# Altium schematic sheet power.SchDoc
size A4
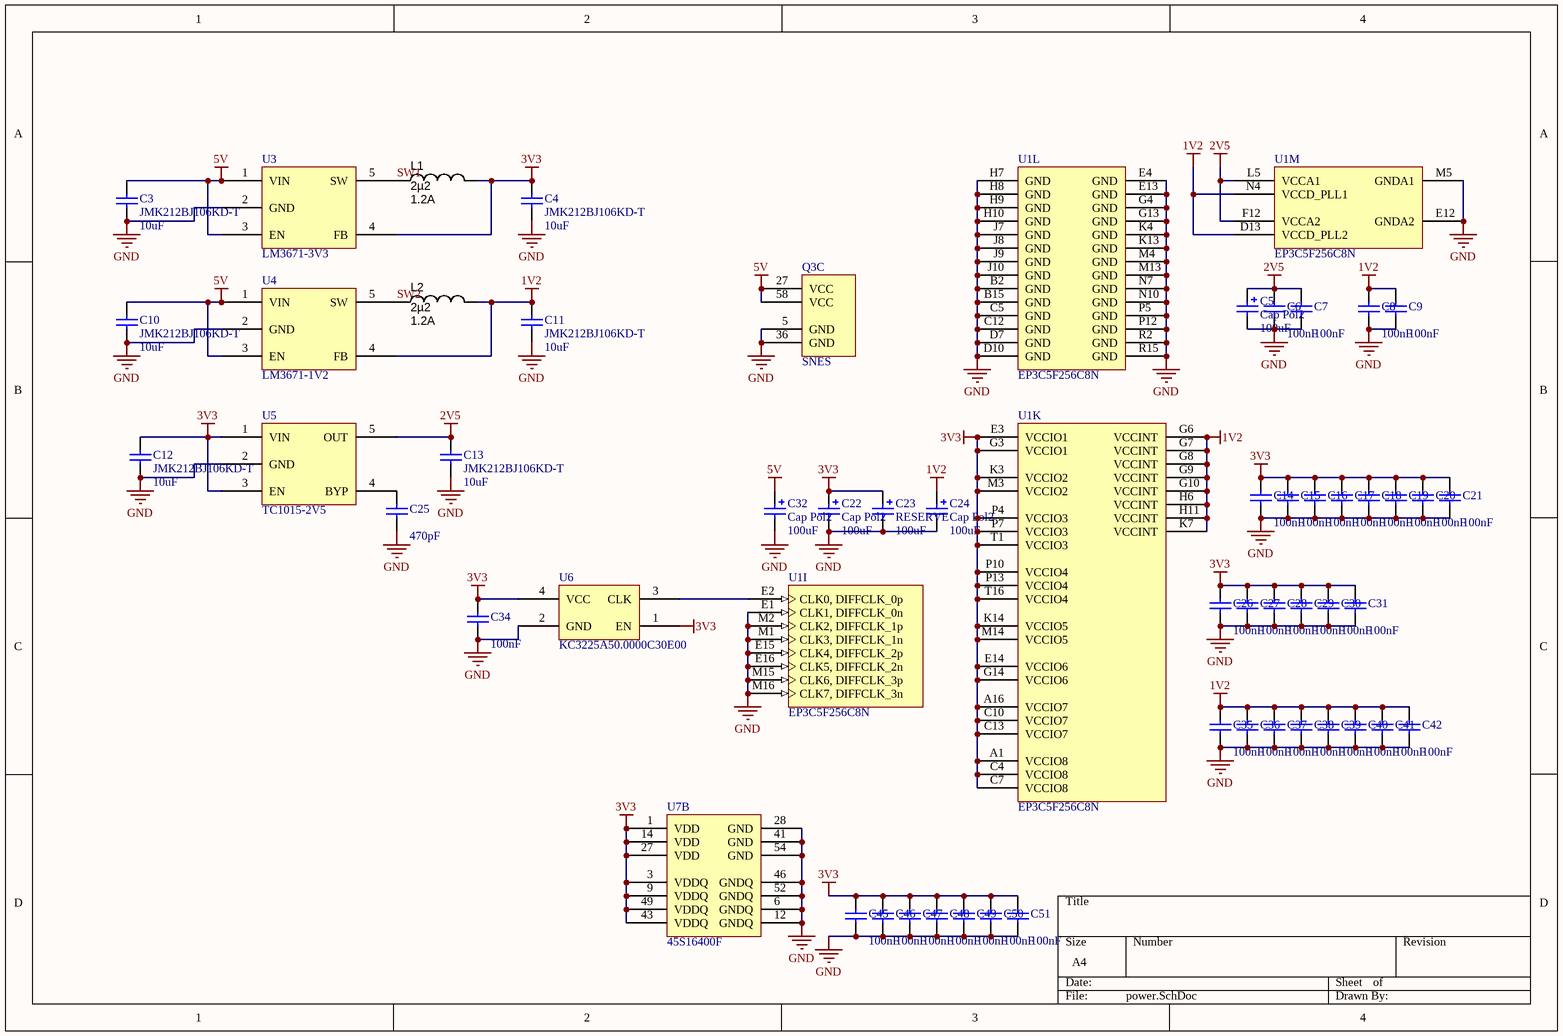
[diagram p0: power.SchDoc]

## Parts
C3  JMK212BJ106KD-T  value 10uF  [CAPC2012X135N]
C4  JMK212BJ106KD-T  value 10uF  [CAPC2012X135N]
C5  Cap Pol2  value 100uF  [CAPC3225X220N]
C6  value 100nF  [CAPC1005X06L]
C7  value 100nF  [CAPC1005X06L]
C8  value 100nF  [CAPC1005X06L]
C9  value 100nF  [CAPC1005X06L]
C10  JMK212BJ106KD-T  value 10uF  [CAPC2012X135N]
C11  JMK212BJ106KD-T  value 10uF  [CAPC2012X135N]
C12  JMK212BJ106KD-T  value 10uF  [CAPC2012X135N]
C13  JMK212BJ106KD-T  value 10uF  [CAPC2012X135N]
C14  value 100nF  [CAPC1005X06L]
C15  value 100nF  [CAPC1005X06L]
C16  value 100nF  [CAPC1005X06L]
C17  value 100nF  [CAPC1005X06L]
C18  value 100nF  [CAPC1005X06L]
C19  value 100nF  [CAPC1005X06L]
C20  value 100nF  [CAPC1005X06L]
C21  value 100nF  [CAPC1005X06L]
C22  Cap Pol2  value 100uF  [CAPC3225X220N]
C23  RESERVE  value 100uF  [CAPC3225X220N]
C24  Cap Pol2  value 100uF  [CAPC3225X220N]
C25  value 470pF  [CAPC2012X135N]
C26  value 100nF  [CAPC1005X06L]
C27  value 100nF  [CAPC1005X06L]
C28  value 100nF  [CAPC1005X06L]
C29  value 100nF  [CAPC1005X06L]
C30  value 100nF  [CAPC1005X06L]
C31  value 100nF  [CAPC1005X06L]
C32  Cap Pol2  value 100uF  [CAPC3225X220N]
C34  value 100nF  [CAPC1005X06L]
C35  value 100nF  [CAPC1005X06L]
C36  value 100nF  [CAPC1005X06L]
C37  value 100nF  [CAPC1005X06L]
C38  value 100nF  [CAPC1005X06L]
C39  value 100nF  [CAPC1005X06L]
C40  value 100nF  [CAPC1005X06L]
C41  value 100nF  [CAPC1005X06L]
C42  value 100nF  [CAPC1005X06L]
C45  value 100nF  [CAPC1005X06L]
C46  value 100nF  [CAPC1005X06L]
C47  value 100nF  [CAPC1005X06L]
C48  value 100nF  [CAPC1005X06L]
C49  value 100nF  [CAPC1005X06L]
C50  value 100nF  [CAPC1005X06L]
C51  value 100nF  [CAPC1005X06L]
L1  1.2A  value 2µ2  [INDM3225X240N]
L2  1.2A  value 2µ2  [INDM3225X240N]
Q3  SNES  [SNES]  (part C of 3)
U1  EP3C5F256C8N  [FBGA256-2]  (parts I,K,L,M of 13)
U3  LM3671-3V3  [SOT23-5]
U4  LM3671-1V2  [SOT23-5]
U5  TC1015-2V5  [SOT23-5]
U6  KC3225A50.0000C30E00  [KC3225A]
U7  45S16400F  [TSOP2-54_N]  (part B of 2)

## Nets
1V2: C8.2 C9.2 C11.2 C24.1 C35.2 C36.2 C37.2 C38.2 C39.2 C40.2 C41.2 C42.2 L2.2 U1.D13(VCCD_PLL2) U1.G6(VCCINT) U1.G7(VCCINT) U1.G8(VCCINT) U1.G9(VCCINT) U1.G10(VCCINT) U1.H6(VCCINT) U1.H11(VCCINT) U1.K7(VCCINT) U1.N4(VCCD_PLL1) U4.4(FB)
2V5: C5.1 C6.2 C7.2 C13.2 U1.F12(VCCA2) U1.L5(VCCA1) U5.5(OUT)
3V3: C4.2 C12.2 C14.2 C15.2 C16.2 C17.2 C18.2 C19.2 C20.2 C21.2 C22.1 C23.1 C26.2 C27.2 C28.2 C29.2 C30.2 C31.2 C34.2 C45.2 C46.2 C47.2 C48.2 C49.2 C50.2 C51.2 L1.2 U1.A1(VCCIO8) U1.A16(VCCIO7) U1.C4(VCCIO8) U1.C7(VCCIO8) U1.C10(VCCIO7) U1.C13(VCCIO7) U1.E3(VCCIO1) U1.E14(VCCIO6) U1.G3(VCCIO1) U1.G14(VCCIO6) U1.K3(VCCIO2) U1.K14(VCCIO5) U1.M3(VCCIO2) U1.M14(VCCIO5) U1.P4(VCCIO3) U1.P7(VCCIO3) U1.P10(VCCIO4) U1.P13(VCCIO4) U1.T1(VCCIO3) U1.T16(VCCIO4) U3.4(FB) U5.1(VIN) U5.3(EN) U6.1(EN) U6.4(VCC) U7.1(VDD) U7.3(VDDQ) U7.9(VDDQ) U7.14(VDD) U7.27(VDD) U7.43(VDDQ) U7.49(VDDQ)
5V: C3.2 C10.2 C32.1 Q3.27(VCC) Q3.58(VCC) U3.1(VIN) U3.3(EN) U4.1(VIN) U4.3(EN)
GND: C3.1 C4.1 C5.2 C6.1 C7.1 C8.1 C9.1 C10.1 C11.1 C12.1 C13.1 C14.1 C15.1 C16.1 C17.1 C18.1 C19.1 C20.1 C21.1 C22.2 C23.2 C24.2 C25.1 C26.1 C27.1 C28.1 C29.1 C30.1 C31.1 C32.2 C34.1 C35.1 C36.1 C37.1 C38.1 C39.1 C40.1 C41.1 C42.1 C45.1 C46.1 C47.1 C48.1 C49.1 C50.1 C51.1 Q3.5(GND) Q3.36(GND) U1.B2(GND) U1.B15(GND) U1.C5(GND) U1.C12(GND) U1.D7(GND) U1.D10(GND) U1.E1(CLK1,_DIFFCLK_0n) U1.E4(GND) U1.E12(GNDA2) U1.E13(GND) U1.E15(CLK4,_DIFFCLK_2p) U1.E16(CLK5,_DIFFCLK_2n) U1.G4(GND) U1.G13(GND) U1.H7(GND) U1.H8(GND) U1.H9(GND) U1.H10(GND) U1.J7(GND) U1.J8(GND) U1.J9(GND) U1.J10(GND) U1.K4(GND) U1.K13(GND) U1.M1(CLK3,_DIFFCLK_1n) U1.M2(CLK2,_DIFFCLK_1p) U1.M4(GND) U1.M5(GNDA1) U1.M13(GND) U1.M15(CLK6,_DIFFCLK_3p) U1.M16(CLK7,_DIFFCLK_3n) U1.N7(GND) U1.N10(GND) U1.P5(GND) U1.P12(GND) U1.R2(GND) U1.R15(GND) U3.2(GND) U4.2(GND) U5.2(GND) U6.2(GND) U7.6(GNDQ) U7.12(GNDQ) U7.28(GND) U7.41(GND) U7.46(GNDQ) U7.52(GNDQ) U7.54(GND)
SW1: L1.1 U3.5(SW)
SW2: L2.1 U4.5(SW)
NetC25_2: C25.2 U5.4(BYP)
NetU1_E2: U1.E2(CLK0,_DIFFCLK_0p) U6.3(CLK)

## Library data of the parts
C3 C4 C6-C21 C25-C31 C34-C42 C45-C51 = Cap: Capacitor; Published: 8-Jun-2000; LatestRevisionDate: 17-Jul-2002; LatestRevisionNote: Re-released for DXP Platform.; PackageReference: RAD-0.3; Publisher: Altium Limited; PackageDescription: Radial Cap, Thru-Hole; 2 Leads; 0.3 in Pin Spacing
C5 C22-C24 C32 = Cap Pol2: Polarized Capacitor (Axial); Published: 8-Jun-2000; LatestRevisionDate: 17-Jul-2002; LatestRevisionNote: Re-released for DXP Platform.; PackageReference: POLAR0.8; Publisher: Altium Limited; PackageDescription: Polarized Capacitor; 2 Leads
L1 L2 = INDC_2u2_1210_1200mA: Inductor 2.2uH 1.2A 1210 SMD chip; Manufacturer 1: TDK Corporation; Manufacturer Part Number 1: NLCV32T-2R2M-PFR; Ratings: 1.2 Adc; Tolerance: ±20%; Type: Ferrite Core; DC Resistance (DCR): 115 mOhm; Q @ Freq: 15 @ 7.96MHz; Frequency - Self Resonant: 68MHz; Frequency - Test: 7.96MHz; SCDType: source; Package / Case: 1210 (3225 Metric); Supplier 1: Digi-Key; Supplier Part Number 1: 445-3650-1-ND; ComponentLink1URL: http://www.tdk.co.jp/tefe02/e511_nlcv_nlc.pdf; ComponentLink1Description: http://www.tdk.co.jp/tefe02/e511_nlcv_nlc.pdf; Operating Temperature: -40°C ~ 125°C
U1 = EP3C5F256C8N: Cyclone III Family FPGA, 182 I/O Pins, 4 PLLs, 256-Pin FBGA, Speed Grade 8, Commercial Grade, Pb-Free; Published: 14-Mar-2008; DatasheetVersion: ver2.0, May-2008; PackageVersion: ver16.0, Dec-2009; PackageReference: FBGA256-2; Publisher: Altium Limited; PackageDescription: 256-Ball FineLine Ball Grid Array (FBGA256) - Option 2 - Wire Bond; Supplier 1: Digi-Key; Supplier Part Number 1: 544-2423-ND; Supplier 2: Farnell; Supplier Part Number 2: 1549367; Supplier 3: Farnell; Supplier Part Number 3: 1662274; Code_JEDEC: MO-192-DAF-1; ComponentLink1Description: Manufacturer Link; ComponentLink1URL: http://www.altera.com/; ComponentLink2Description: Handbook (7.86MB); ComponentLink2URL: http://www.altera.com/literature/hb/cyc3/cyclone3_handbook.pdf; ComponentLink3Description: Packaging Specification; ComponentLink3URL: http://www.altera.com/literature/ds/dspkg.pdf
U3 U4 = LM3671
U5 = TC1015
U6 = osc